# Altium project PCB_Project_1.PrjPcb
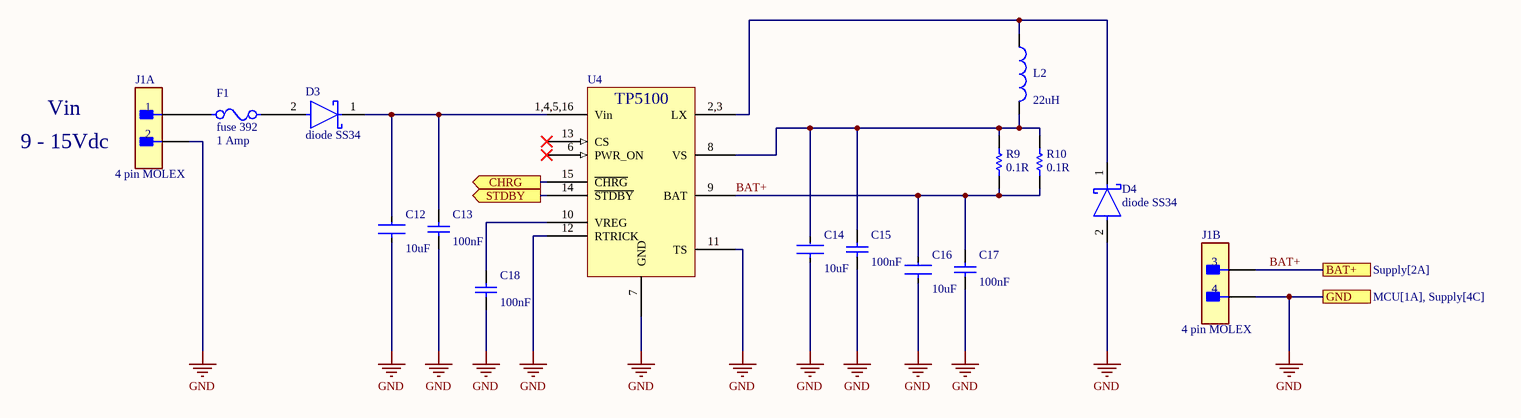
[diagram p0: Li-Ion Charger.SchDoc]
3 sheets, 63 parts. Net scope: flat (ports and power ports of the same name join across sheets).
Board file: PCB1.PcbDoc
Sheets:
  Li-Ion Charger.SchDoc
  Supply.SchDoc
  MCU.SchDoc

## Sheet Li-Ion Charger.SchDoc
size A4; SheetNumber: 1; SheetTotal: 3

### Parts
C12  value 10uF  [FP-GRM31-0_2-IPC_B]  (hidden comment: capacitor smd 1206 10uF)
C13  value 100nF  [CAPC2013X140X50LL20T25]  (hidden comment: capacitor smd 0805 100nF)
C14  value 10uF  [FP-GRM31-0_2-IPC_B]  (hidden comment: capacitor smd 1206 10uF)
C15  value 100nF  [CAPC2013X140X50LL20T25]  (hidden comment: capacitor smd 0805 100nF)
C16  value 10uF  [FP-GRM31-0_2-IPC_B]  (hidden comment: capacitor smd 1206 10uF)
C17  value 100nF  [CAPC2013X140X50LL20T25]  (hidden comment: capacitor smd 0805 100nF)
C18  value 100nF  [CAPC2013X140X50LL20T25]  (hidden comment: capacitor smd 0805 100nF)
D3  diode SS34  [FP-SS34LWH-MFG]
D4  diode SS34  [FP-SS34LWH-MFG]
F1  fuse 392  value 1 Amp  [FP-396-MFG]
J1  4 pin MOLEX  [FP-39-29-3046-MFG]  (parts A,B of 2)
L2  value 22uH  [WE-PD 1050]  (hidden comment: power inductor 220uH)
R9  value 0.1R  [RESC3216X89X51NL25T25]  (hidden comment: resistor smd 1206 R100)
R10  value 0.1R  [RESC3216X89X51NL25T25]  (hidden comment: resistor smd 1206 R100)
U4  TP5100  [QFN65P400X400X90_HS-17M]  (value not drawn)

### Ports
BAT+ (see Supply[2A]), CHRG (out), GND (see MCU[1A], Supply[4C]), STDBY (out)

### Nets
GND: C12.1 C13.1 C14.1 C15.1 C16.1 C17.1 C18.1 D4.2(A) J1.2 J1.4 U4.7(GND) U4.11(TS) U4.12(RTRICK) ; port GND
BAT+: C16.2 C17.2 J1.3 R9.1 R10.1 U4.9(BAT) ; port BAT+
NetC12_2: C12.2 C13.2 D3.1(C) U4.1,4,5,16(Vin)
NetC14_2: C14.2 C15.2 L2.2 R9.2 R10.2 U4.8(VS)
NetC18_2: C18.2 U4.10(VREG)
NetD3_2: D3.2(A) F1.2
NetD4_1: D4.1(C) L2.1 U4.2,3(LX)
NetF1_1: F1.1 J1.1
NetMD?_6: U4.14(~{STDBY}) ; port STDBY
NetMD?_7: U4.15(~{CHRG}) ; port CHRG

Not connected (* = marked no-connect by the designer): U4 6(PWR_ON)* 13(CS)*

### Notes on the sheet
- Vin
- (near J1) 9 - 15Vdc

### Library data of the parts
C12 C14 C16 = CMP-001-00086-1: Multilayer Ceramic Capacitors MLCC - SMD/SMT 1206 10uF 50volt X5R +/-10%
C13 C15 C17 C18 = CMP-001-00085-1: Cap Ceramic 0.1uF 50V X7R 10% Pad SMD 0805 FlexiTerm 125C Automotive T/R
D3 D4 = CMP-004-00032-2: Rectifier Diode Schottky 40V 3A Automotive 2-Pin SOD-123W T/R
F1 = CMP-005-00013-1: Fuse Subminiature Slow Blow Acting 0.05A 125V Radial 8.5 X 4 X 8mm Bulk UL
J1 = CMP-002-00073-1: Connector Wire to Board Header 4 Position 4.2mm Solder Straight Thru-Hole
L2 = CMP-006-00021-1: Fixed Ind 22UH 1A 439 Mohm SMD
R9 R10 = CMP-009-00178-1: Res Metal Strip 1206 0.1 Ohm 1% 1/4W ±75ppm/°C Molded SMD SMD Embossed Plastic T/R
U4 = CMP-019-00049-3: 2A-switch buck 8.4V / 4.2V rechargeable lithium battery Charger

## Sheet Supply.SchDoc
size A4; SheetNumber: 2; SheetTotal: 3
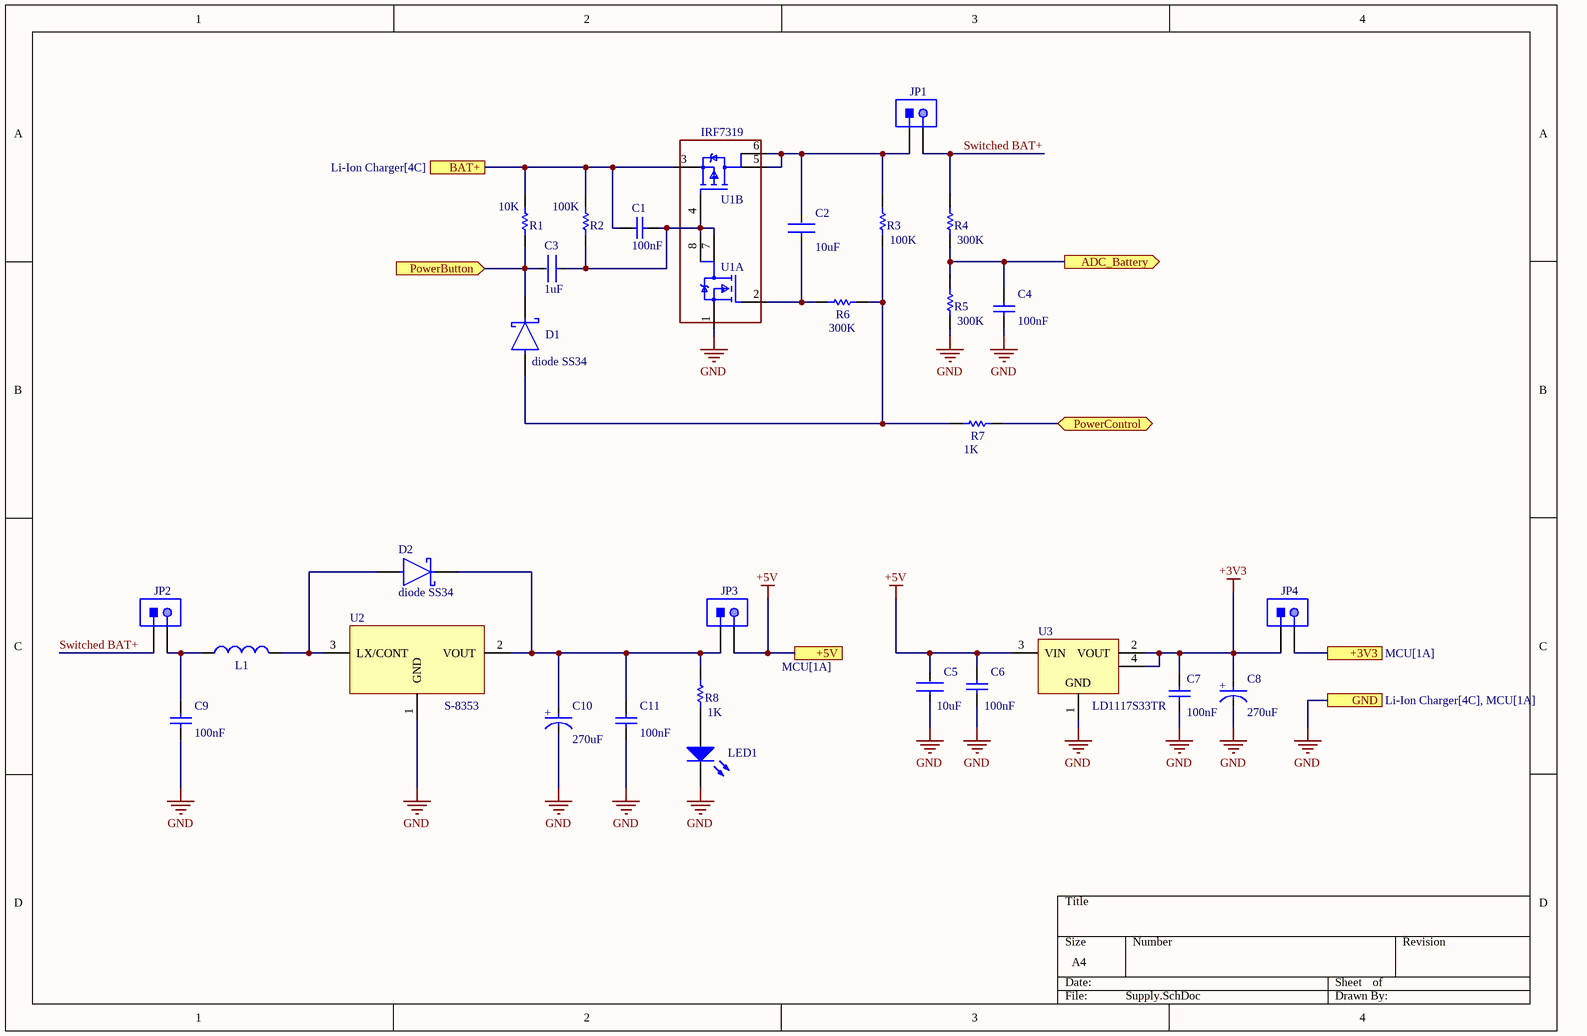
[diagram p1: Supply.SchDoc]

### Parts
C1  value 100nF  [CAPC2013X140X50LL20T25]  (hidden comment: capacitor smd 0805 100nF)
C2  value 10uF  [FP-GRM31-0_2-IPC_B]  (hidden comment: capacitor smd 1206 10uF)
C3  value 1uF  [FP-GRM31-0_2-IPC_B]  (hidden comment: capacitor smd 1206 10uF)
C4  value 100nF  [CAPC2013X140X50LL20T25]  (hidden comment: capacitor smd 0805 100nF)
C5  value 10uF  [FP-GRM31-0_2-IPC_B]  (hidden comment: capacitor smd 1206 10uF)
C6  value 100nF  [CAPC2013X140X50LL20T25]  (hidden comment: capacitor smd 0805 100nF)
C7  value 100nF  [CAPC2013X140X50LL20T25]  (hidden comment: capacitor smd 0805 100nF)
C8  value 270uF  [FP-OS-CON-TH-E12-d_0_6-MFG]  (hidden comment: capacitor 270uF 16V)
C9  value 100nF  [CAPC2013X140X50LL20T25]  (hidden comment: capacitor smd 0805 100nF)
C10  value 270uF  [FP-OS-CON-TH-E12-d_0_6-MFG]  (hidden comment: capacitor 270uF 16V)
C11  value 100nF  [CAPC2013X140X50LL20T25]  (hidden comment: capacitor smd 0805 100nF)
D1  diode SS34  [FP-SS34LWH-MFG]
D2  diode SS34  [FP-SS34LWH-MFG]
JP1  header 2.54 2pin  [61300211121]  (value not drawn)
JP2  header 2.54 2pin  [61300211121]  (value not drawn)
JP3  header 2.54 2pin  [61300211121]  (value not drawn)
JP4  header 2.54 2pin  [61300211121]  (value not drawn)
L1  power inductor 470uH  [WE-PD4-S]  (value not drawn)
LED1  LED green 0805  [0805_A]  (value not drawn)
R1  value 10K  [RESC2013X50X30ML20T20]  (hidden comment: resistor smd 0805 1K)
R2  value 100K  [RESC2013X50X30ML20T20]  (hidden comment: resistor smd 0805 1K)
R3  value 100K  [RESC2013X50X30ML20T20]  (hidden comment: resistor smd 0805 1K)
R4  value 300K  [RESC2013X50X30ML20T20]  (hidden comment: resistor smd 0805 1K)
R5  value 300K  [RESC2013X50X30ML20T20]  (hidden comment: resistor smd 0805 1K)
R6  value 300K  [RESC2013X50X30ML20T20]  (hidden comment: resistor smd 0805 1K)
R7  value 1K  [RESC2013X50X30ML20T20]  (hidden comment: resistor smd 0805 1K)
R8  value 1K  [RESC2013X50X30ML20T20]  (hidden comment: resistor smd 0805 1K)
U1  IRF7319  [FP-PG-DSO-8-IPC_B]  (parts A,B of 2)
U2  S-8353  [SOT89-150P410X160-3N]
U3  LD1117S33TR  [SOT-223_L]

### Ports
+3V3 (see MCU[1A]), +5V (see MCU[1A]), ADC_Battery (out), BAT+ (see Li-Ion Charger[4C]), GND (see Li-Ion Charger[4C], MCU[1A]), PowerButton (in), PowerControl (bidir)

### Nets
+3V3: C7.2 C8.2(A) JP4.1 JP4.2 U3.2(VOUT) U3.4(VOUT) ; port +3V3
+5V: C5.2 C6.2 JP3.2 U3.3(VIN) ; port +5V
GND: C4.1 C5.1 C6.1 C7.1 C8.1(C) C9.1 C10.1(C) C11.1 LED1.1(K) R5.1 U1.1(S1) U2.1(GND) U3.1(GND) ; port GND
BAT+: C1.2 R1.2 R2.2 U1.3(S2) ; port BAT+
Switched BAT+: JP1.2 JP2.1 R4.2
NetC1_1: C1.1 C3.1 R2.1 U1.4(G2) U1.7(D1) U1.8(D1)
NetC2_1: C2.1 R6.1 U1.2(G1)
NetC2_2: C2.2 JP1.1 R3.2 U1.5(D2) U1.6(D2)
NetC3_2: C3.2 D1.1(C) R1.1 ; port PowerButton
NetC4_2: C4.2 R4.1 R5.2 ; port ADC_Battery
NetC9_2: C9.2 JP2.2 L1.1
NetC10_2: C10.2(A) C11.2 D2.1(C) JP3.1 R8.2 U2.2(VOUT)
NetD1_2: D1.2(A) R3.1 R6.2 R7.1
NetD2_2: D2.2(A) L1.2 U2.3(LX/CONT)
NetLED1_2: LED1.2(A) R8.1
NetMD?_12: R7.2 ; port PowerControl

### Notes on the sheet
- (in symbol CMP-001-00087-1) +

### Library data of the parts
C1 C4 C6 C7 C9 C11 = CMP-001-00085-1: as C13 on sheet Li-Ion Charger
C2 C3 C5 = CMP-001-00086-1: as C12 on sheet Li-Ion Charger
C8 C10 = CMP-001-00087-1: Cap Aluminum Polymer 270uF 16VDC 20% (8 X 12mm) Radial 3.5mm 0.011 Ohm 5000mA 5000h 105C T/R
D1 D2 = CMP-004-00032-2: as D3 on sheet Li-Ion Charger
JP1-JP4 = CMP-002-00072-1: CONN HEADER 2 POS 2.54
L1 = CMP-006-00022-2: Surface Mount Power Inductor, We-Pd4 Series, 470 H, 20%, Unshielded, 6.8 Ohm, 160 Ma Rohs Compliant: Yes
LED1 = CMP-007-00036-1: Led, Green, 520 Nm, 3.2 V, 30 Ma, 450 Mcd Rohs Compliant: Yes
R1-R8 = CMP-009-00179-1: Res Thick Film 0805 1K Ohm 1% 1/8W ±100ppm/°C Molded SMD Paper T/R
U1 = CMP-013-00034-1: IRF7309PBF Dual N/P-channel MOSFET Transistor; 3 A; 4 A; 30 V; 8-Pin SOIC
U2 = CMP-019-00051-1
U3 = CMP-019-00050-1: IC REG LDO 3.3V 0.8A SOT223

## Sheet MCU.SchDoc
size A4; SheetNumber: 3; SheetTotal: 3
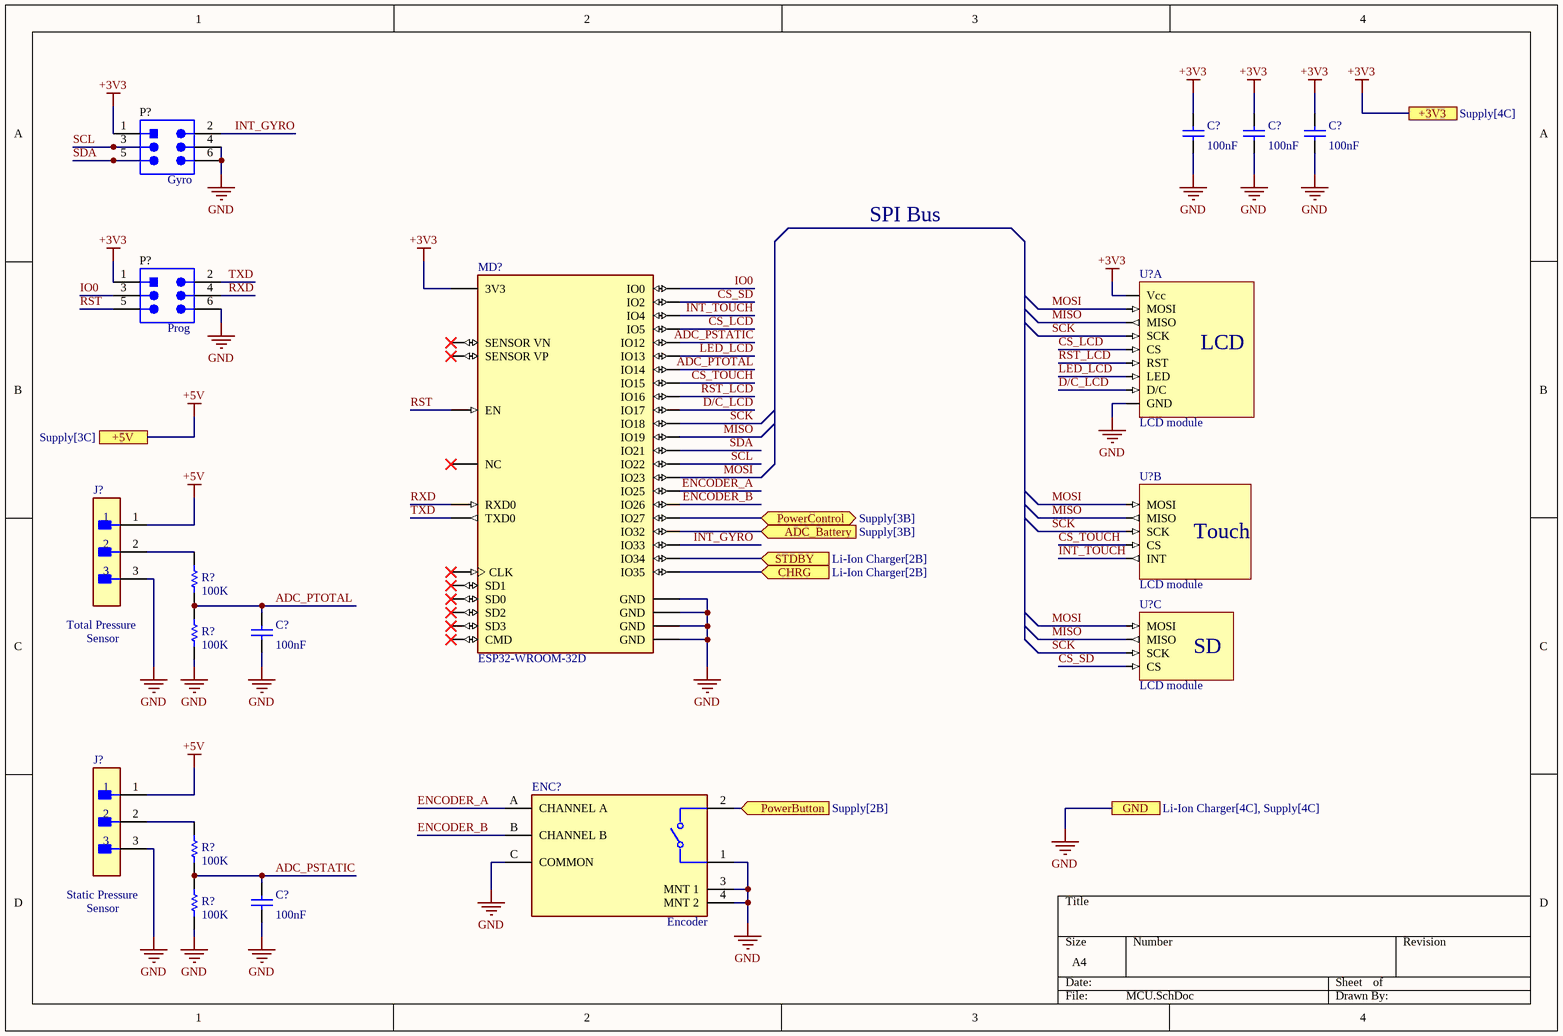
[diagram p2: MCU.SchDoc]

### Parts
(Parts that share a designator on the sheet are numbered #1, #2 ... from top to bottom, then left to right.)
C?#1  value 100nF  [CAPC2013X140X50LL20T25]  (hidden comment: capacitor smd 0805 100nF)
C?#2  value 100nF  [CAPC2013X140X50LL20T25]  (hidden comment: capacitor smd 0805 100nF)
C?#3  value 100nF  [CAPC2013X140X50LL20T25]  (hidden comment: capacitor smd 0805 100nF)
C?#4  value 100nF  [CAPC2013X140X50LL20T25]  (hidden comment: capacitor smd 0805 100nF)
C?#5  value 100nF  [CAPC2013X140X50LL20T25]  (hidden comment: capacitor smd 0805 100nF)
ENC?  Encoder 6mm  [FP-PEC11R-4220K-S0024-MFG]  (value not drawn)
J?#1  Goldpin 3 Pin 2.54mm  [FP-87224-3-MFG]  (value not drawn)
J?#2  Goldpin 3 Pin 2.54mm  [FP-87224-3-MFG]  (value not drawn)
MD?  ESP32-WROOM-32D  [FP-ESP32-WROOM-32D-MFG]
P?#1  Goldpin 2x3 Pin 2.54  [SMTC-TSW-103-08-L-D_V]  (value not drawn)
P?#2  Goldpin 2x3 Pin 2.54  [SMTC-TSW-103-08-L-D_V]  (value not drawn)
R?#1  value 100K  [RESC2013X50X30ML20T20]  (hidden comment: resistor smd 0805 1K)
R?#2  value 100K  [RESC2013X50X30ML20T20]  (hidden comment: resistor smd 0805 1K)
R?#3  value 100K  [RESC2013X50X30ML20T20]  (hidden comment: resistor smd 0805 1K)
R?#4  value 100K  [RESC2013X50X30ML20T20]  (hidden comment: resistor smd 0805 1K)
U?#1  LCD module  [LCD module-Footprint-1]  (part A of 3)
U?#2  LCD module  [LCD module-Footprint-1]  (part B of 3)
U?#3  LCD module  [LCD module-Footprint-1]  (part C of 3)

### Ports
+3V3 (see Supply[4C]), +5V (see Supply[3C]), ADC_Battery (in, see Supply[3B]), CHRG (in, see Li-Ion Charger[2B]), GND (see Li-Ion Charger[4C], Supply[4C]), PowerButton (in, see Supply[2B]), PowerControl (bidir, see Supply[3B]), STDBY (in, see Li-Ion Charger[2B])

### Nets
+3V3: C?#1.2 C?#2.2 C?#3.2 MD?.2(3V3) P?#1.1 P?#2.1 U?#1.1(Vcc) ; port +3V3
+5V: J?#1.1 J?#2.1 ; port +5V
GND: C?#1.1 C?#2.1 C?#3.1 C?#4.1 C?#5.1 ENC?.1 ENC?.3(MNT_1) ENC?.4(MNT_2) ENC?.C(COMMON) J?#1.3 J?#2.3 MD?.1(GND) MD?.15(GND) MD?.38(GND) MD?.39(GND) P?#1.4 P?#1.6 P?#2.6 R?#2.1 R?#4.1 U?#1.2(GND) ; port GND
ADC_PSTATIC: C?#5.2 MD?.14(IO12) R?#3.1 R?#4.2
ADC_PTOTAL: C?#4.2 MD?.13(IO14) R?#1.1 R?#2.2
CS_LCD: MD?.29(IO5) U?#1.3(CS)
CS_SD: MD?.24(IO2) U?#3.15(CS)
CS_TOUCH: MD?.23(IO15) U?#2.11(CS)
D/C_LCD: MD?.28(IO17) U?#1.5(D/C)
ENCODER_A: ENC?.A(CHANNEL_A) MD?.10(IO25)
ENCODER_B: ENC?.B(CHANNEL_B) MD?.11(IO26)
INT_GYRO: MD?.9(IO33) P?#1.2
INT_TOUCH: MD?.26(IO4) U?#2.14(INT)
IO0: MD?.25(IO0) P?#2.3
LED_LCD: MD?.16(IO13) U?#1.8(LED)
MISO: MD?.31(IO19) U?#1.9(MISO) U?#2.13(MISO) U?#3.17(MISO)
MOSI: MD?.37(IO23) U?#1.6(MOSI) U?#2.12(MOSI) U?#3.16(MOSI)
RST: MD?.3(EN) P?#2.5
RST_LCD: MD?.27(IO16) U?#1.4(RST)
RXD: MD?.34(RXD0) P?#2.4
SCK: MD?.30(IO18) U?#1.7(SCK) U?#2.10(SCK) U?#3.18(SCK)
SCL: MD?.36(IO22) P?#1.3
SDA: MD?.33(IO21) P?#1.5
TXD: MD?.35(TXD0) P?#2.2
NetC3_2: ENC?.2 ; port PowerButton
NetC4_2: MD?.8(IO32) ; port ADC_Battery
NetJ?#1_2: J?#1.2 R?#1.2
NetJ?#2_2: J?#2.2 R?#3.2
NetMD?_6: MD?.6(IO34) ; port STDBY
NetMD?_7: MD?.7(IO35) ; port CHRG
NetMD?_12: MD?.12(IO27) ; port PowerControl

Not connected (* = marked no-connect by the designer): MD? 4(SENSOR_VP)* 5(SENSOR_VN)* 17(SD2)* 18(SD3)* 19(CMD)* 20(CLK)* 21(SD0)* 22(SD1)* 32(NC)*

### Notes on the sheet
- (near P?#1) Gyro
- SPI Bus
- (near P?#2) Prog
- Total Pressure
- Sensor
- Static Pressure
- (near ENC?) Encoder
- (in symbol CMP-00026-00002-3, part A) LCD
- (in symbol CMP-00026-00002-3, part B) Touch
- (in symbol CMP-00026-00002-3, part C) SD

### Library data of the parts
C?#1-C?#5 = CMP-001-00085-1: as C13 on sheet Li-Ion Charger
ENC? = CMP-011-00013-1: 24 Pulse Incremental Mechanical Rotary Encoder w/ 6 mm Knurl Shaft; Through Hole
J?#1 J?#2 = CMP-002-00075-1: Header; Standard; PCB Mount; Single; 3; 0.025 in.; 0.125 in.; Square; 0.1 in.
MD? = CMP-020-00024-1: Wi-Fi/BT BLE Module ESP32-D0WD, SPI Flash, UART, P
P?#1 P?#2 = CMP-002-00076-1: Conn Unshrouded Header HDR 6 POS 2.54mm Solder ST Top Entry Thru-Hole Bag
R?#1-R?#4 = CMP-009-00179-1: as R1 on sheet Supply
U?#1-U?#3 = CMP-00026-00002-3: modul wyswietlacza TFT z kontrolerem touch i karta SD

## Nets that join several sheets
+3V3: Supply (6 pins), MCU (7 pins)
+5V: Supply (C5.2 C6.2 JP3.2 U3.3), MCU (J?#1.1 J?#2.1)
GND: Li-Ion Charger (13 pins), Supply (13 pins), MCU (21 pins)
BAT+: Li-Ion Charger (6 pins), Supply (C1.2 R1.2 R2.2 U1.3)
NetC3_2: Supply (C3.2 D1.1 R1.1), MCU (ENC?.2)
NetC4_2: Supply (C4.2 R4.1 R5.2), MCU (MD?.8)
NetMD?_6: Li-Ion Charger (U4.14), MCU (MD?.6)
NetMD?_7: Li-Ion Charger (U4.15), MCU (MD?.7)
NetMD?_12: Supply (R7.2), MCU (MD?.12)